# EAGLE schematic teensyShield4.1b (EAGLE 7.7.0)
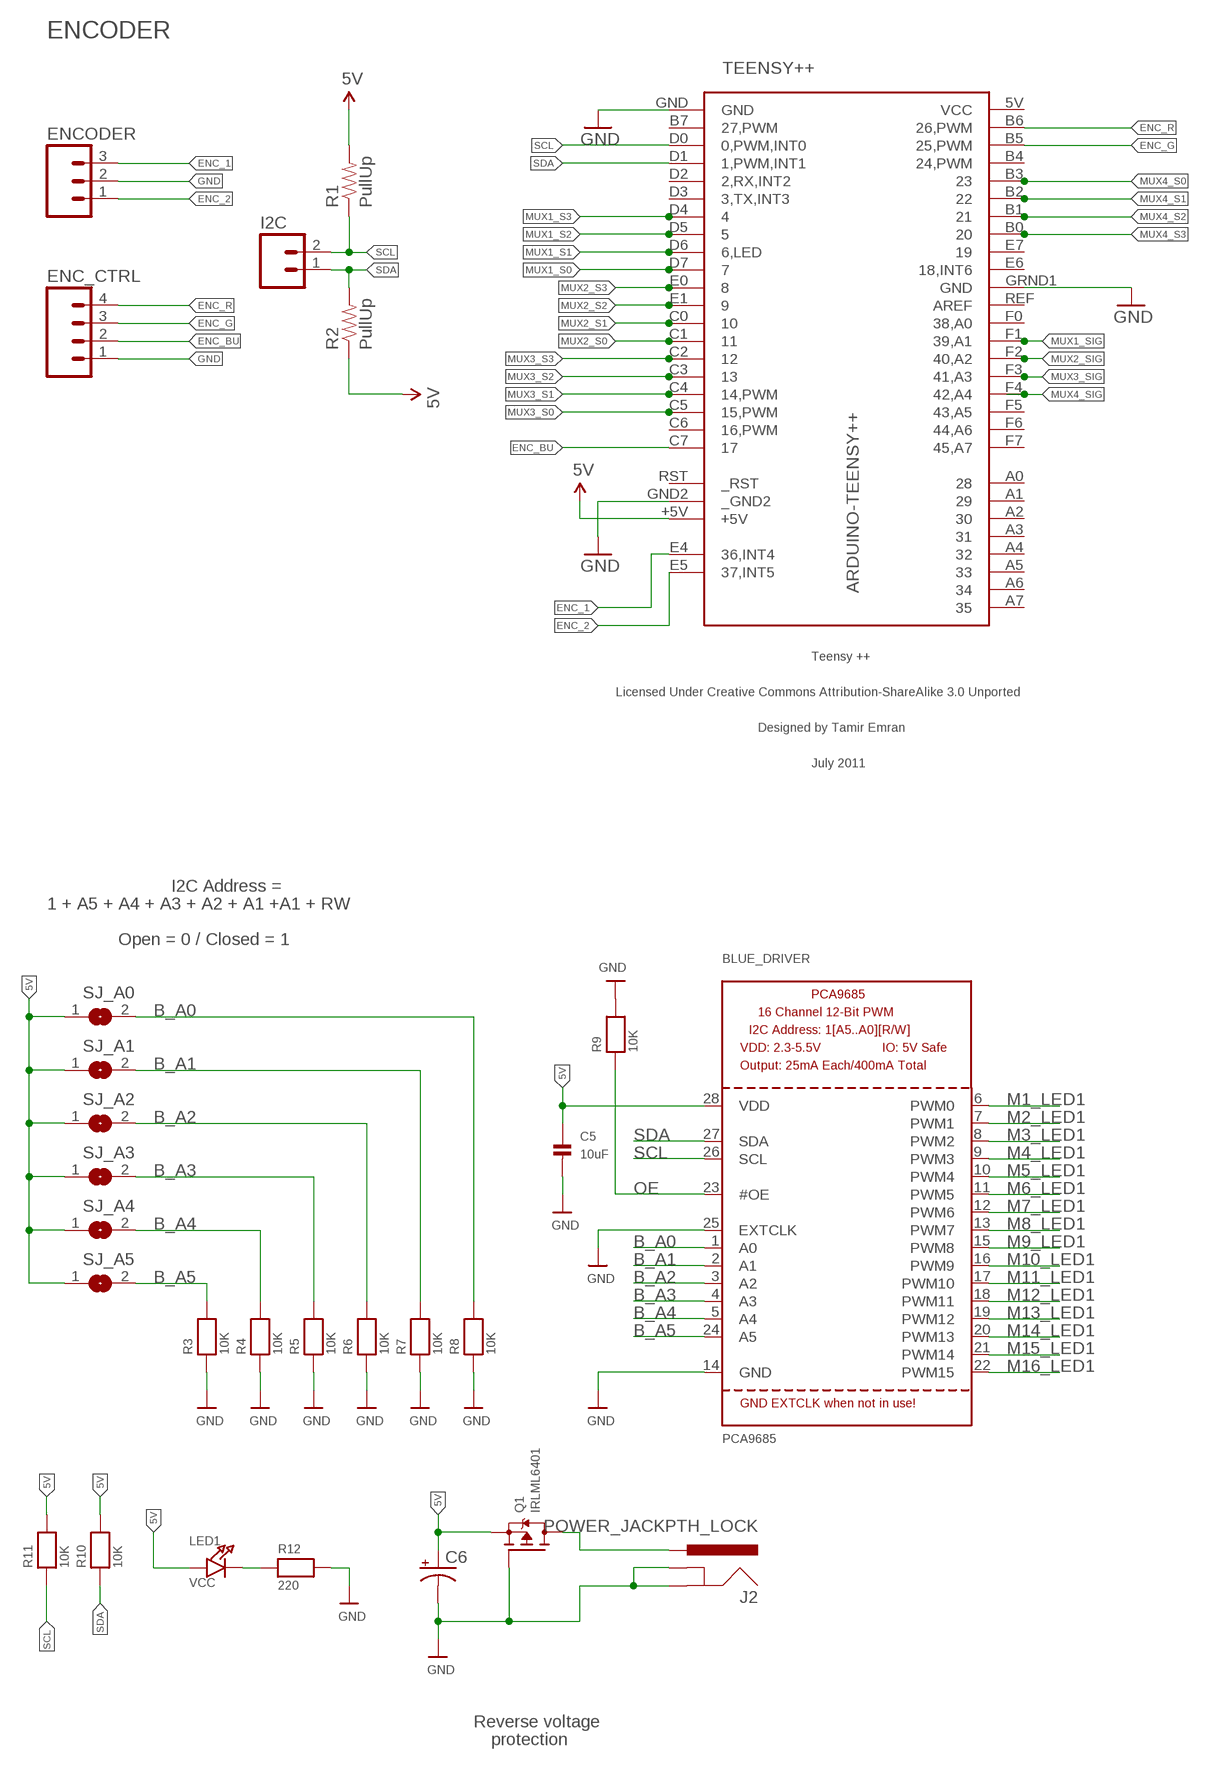
[diagram p0: schematic, sheet 1, part 1 of 2]
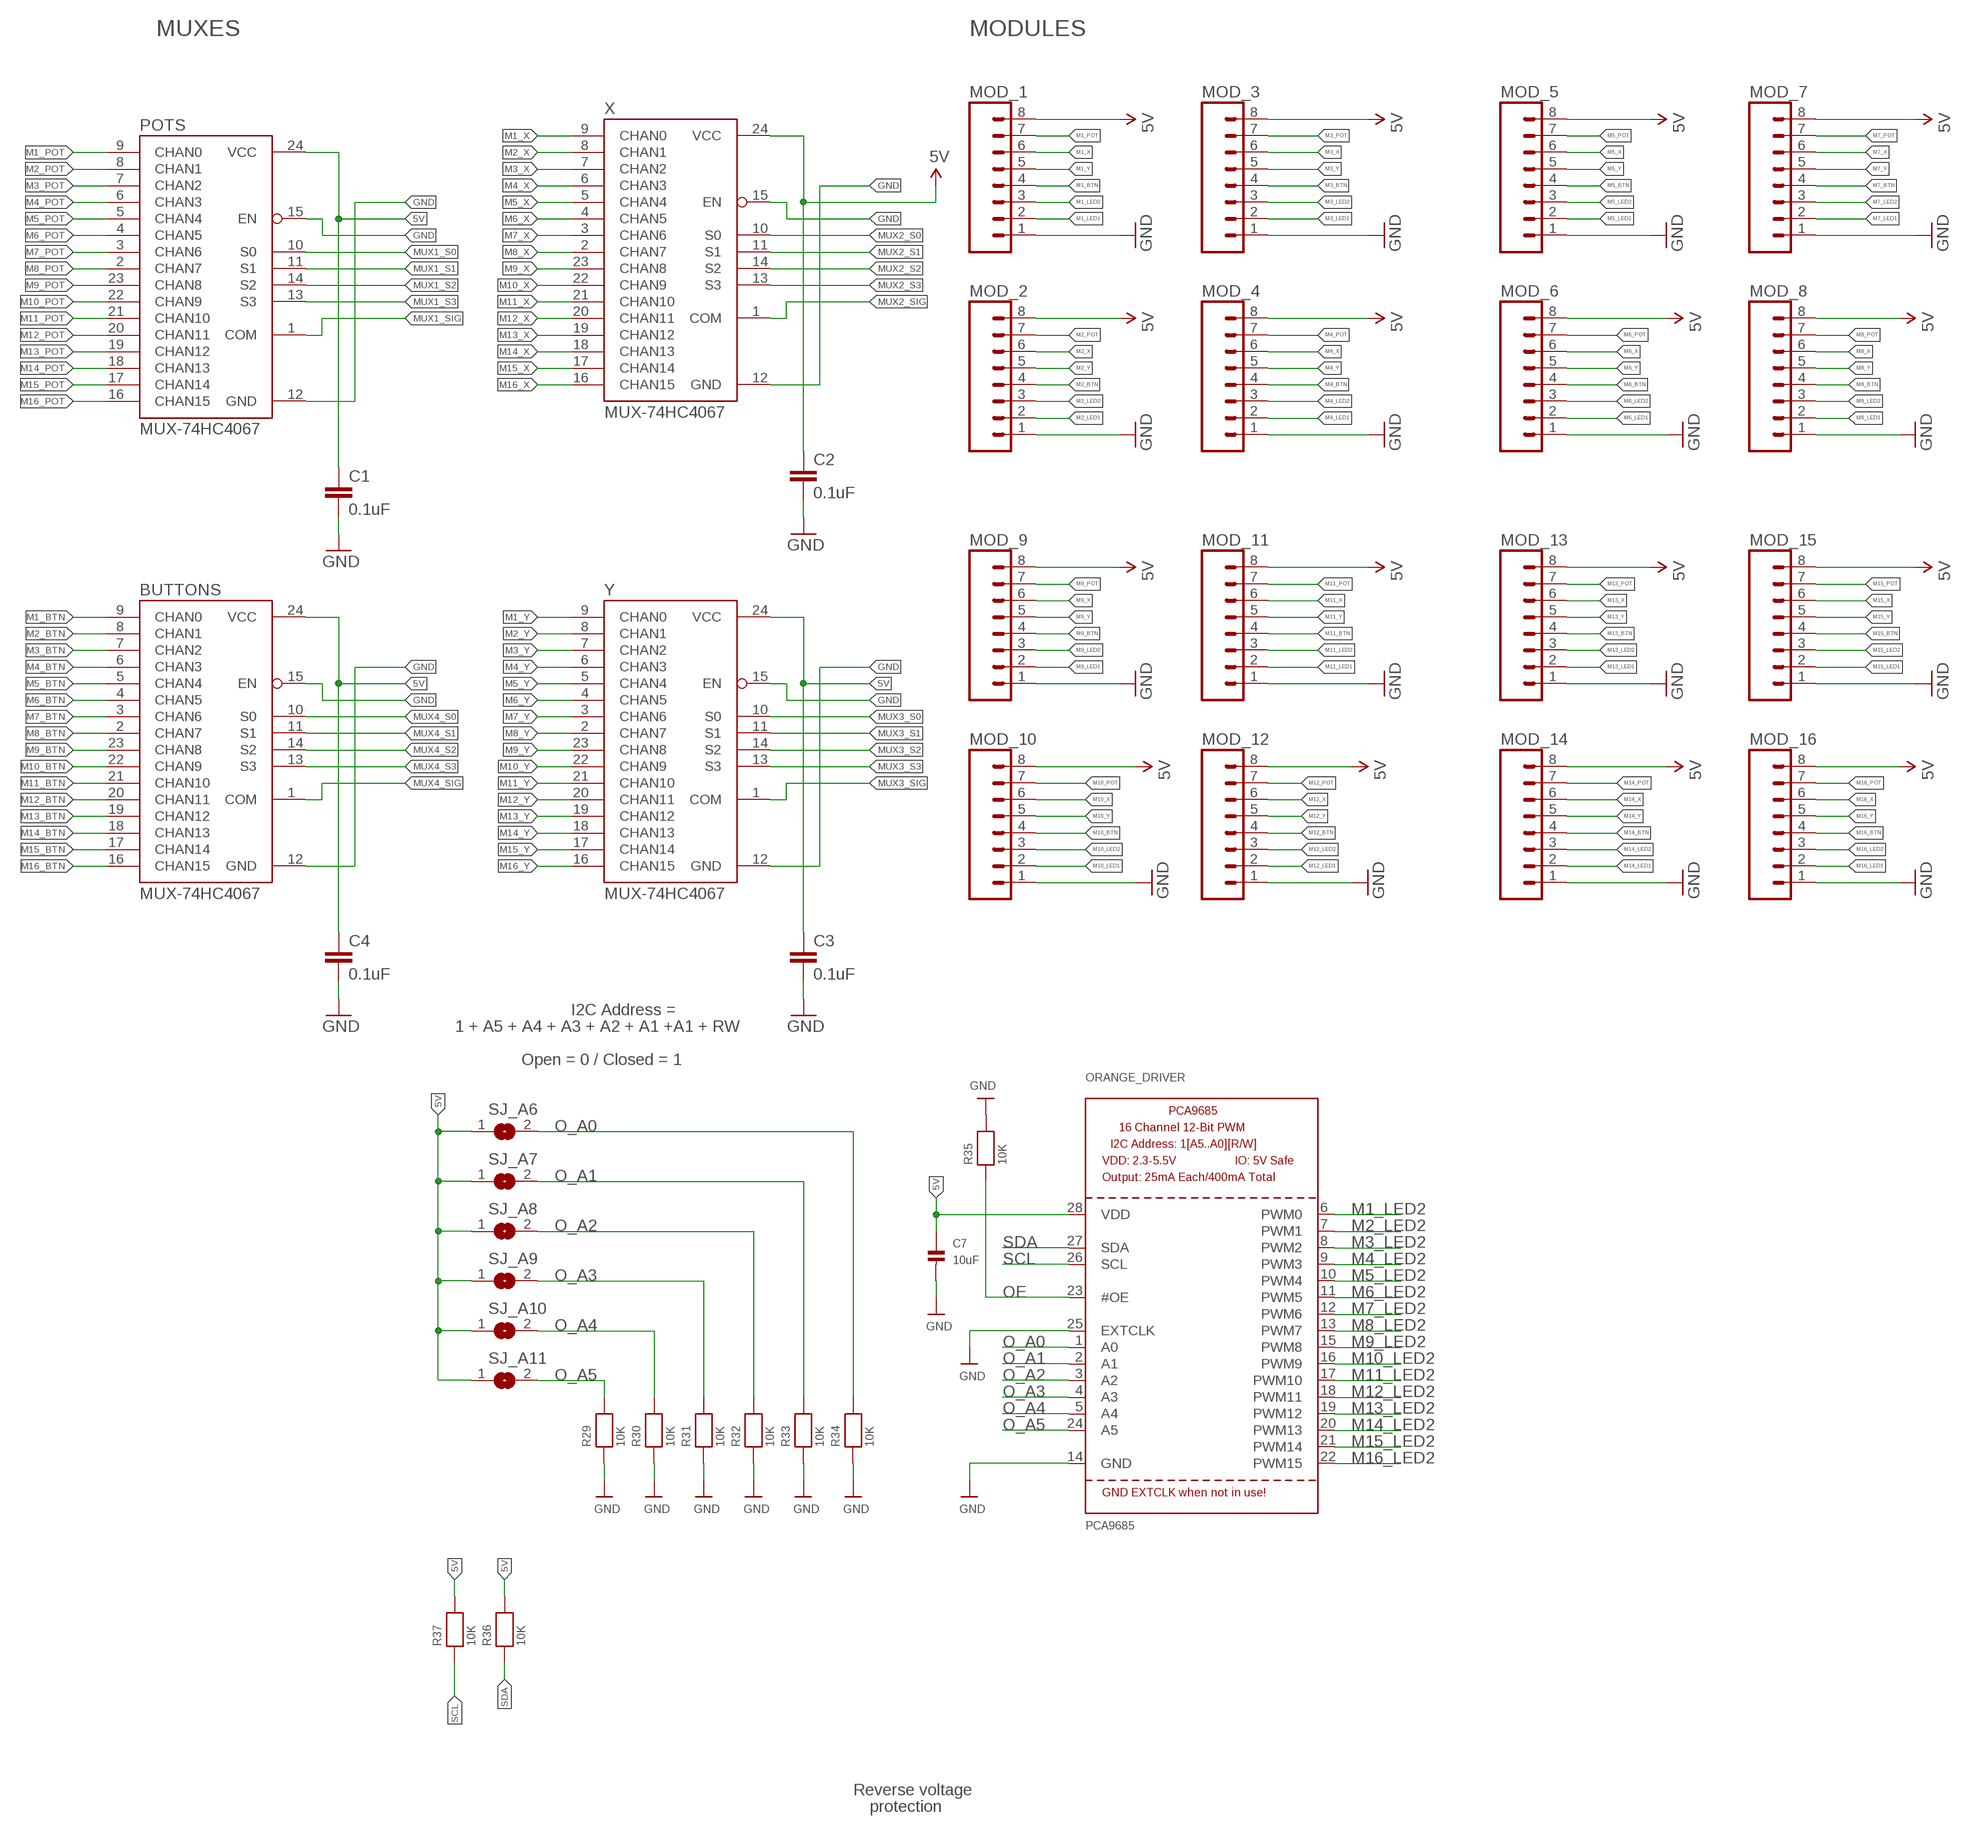
[diagram p1: schematic, sheet 1, part 2 of 2]

## Parts
BLUE_DRIVER  PCA9685  [TSSOP28]
BUTTONS  MUX-74HC4067  MUX-74HC4067SMD  [SSOP24]
C1  0.1uF  CAP0603  [0603]
C2  0.1uF  CAP0603  [0603]
C3  0.1uF  CAP0603  [0603]
C4  0.1uF  CAP0603  [0603]
C5  10uF  CAP_CERAMIC0805  [0805]
C6  CPOL-USE3.5-8  [E3,5-8]
C7  10uF  CAP_CERAMIC0805  [0805]
ENC_CTRL  M041X04_NO_SILK  [1X04_NO_SILK]
ENCODER  M031X03_NO_SILK  [1X03_NO_SILK]
I2C  M02LOCK  [1X02_LOCK]
J2  POWER_JACKPTH_LOCK  [POWER_JACK_PTH_LOCK]
LED1  VCC  LED0805  [CHIPLED_0805]
MOD_1  M08  [1X08_ROUND]
MOD_2  M08  [1X08_ROUND]
MOD_3  M08  [1X08_ROUND]
MOD_4  M08  [1X08_ROUND]
MOD_5  M08  [1X08_ROUND]
MOD_6  M08  [1X08_ROUND]
MOD_7  M08  [1X08_ROUND]
MOD_8  M08  [1X08_ROUND]
MOD_9  M08  [1X08_ROUND]
MOD_10  M08  [1X08_ROUND]
MOD_11  M08  [1X08_ROUND]
MOD_12  M08  [1X08_ROUND]
MOD_13  M08  [1X08_ROUND]
MOD_14  M08  [1X08_ROUND]
MOD_15  M08  [1X08_ROUND]
MOD_16  M08  [1X08_ROUND]
ORANGE_DRIVER  PCA9685  [TSSOP28]
POTS  MUX-74HC4067  MUX-74HC4067SMD  [SSOP24]
Q1  IRLML6401  MOSFET-PWIDE  [SOT23-WIDE]
R1  PullUp  10KOHM-1/4W5%(PTH)  [AXIAL-0.3]
R2  PullUp  10KOHM-1/4W5%(PTH)  [AXIAL-0.3]
R3  10K  RESISTOR0805  [0805]
R4  10K  RESISTOR0805  [0805]
R5  10K  RESISTOR0805  [0805]
R6  10K  RESISTOR0805  [0805]
R7  10K  RESISTOR0805  [0805]
R8  10K  RESISTOR0805  [0805]
R9  10K  RESISTOR0805  [0805]
R10  10K  RESISTOR0805  [0805]
R11  10K  RESISTOR0805  [0805]
R12  220  RESISTOR0805  [0805]
R29  10K  RESISTOR0805  [0805]
R30  10K  RESISTOR0805  [0805]
R31  10K  RESISTOR0805  [0805]
R32  10K  RESISTOR0805  [0805]
R33  10K  RESISTOR0805  [0805]
R34  10K  RESISTOR0805  [0805]
R35  10K  RESISTOR0805  [0805]
R36  10K  RESISTOR0805  [0805]
R37  10K  RESISTOR0805  [0805]
SJ_A0  SOLDERJUMPERREFLOW_NOPASTE  [SOLDERJUMPER_REFLOW_NOPASTE]
SJ_A1  SOLDERJUMPERREFLOW_NOPASTE  [SOLDERJUMPER_REFLOW_NOPASTE]
SJ_A2  SOLDERJUMPERREFLOW_NOPASTE  [SOLDERJUMPER_REFLOW_NOPASTE]
SJ_A3  SOLDERJUMPERREFLOW_NOPASTE  [SOLDERJUMPER_REFLOW_NOPASTE]
SJ_A4  SOLDERJUMPERREFLOW_NOPASTE  [SOLDERJUMPER_REFLOW_NOPASTE]
SJ_A5  SOLDERJUMPERREFLOW_NOPASTE  [SOLDERJUMPER_REFLOW_NOPASTE]
SJ_A6  SOLDERJUMPERREFLOW_NOPASTE  [SOLDERJUMPER_REFLOW_NOPASTE]
SJ_A7  SOLDERJUMPERREFLOW_NOPASTE  [SOLDERJUMPER_REFLOW_NOPASTE]
SJ_A8  SOLDERJUMPERREFLOW_NOPASTE  [SOLDERJUMPER_REFLOW_NOPASTE]
SJ_A9  SOLDERJUMPERREFLOW_NOPASTE  [SOLDERJUMPER_REFLOW_NOPASTE]
SJ_A10  SOLDERJUMPERREFLOW_NOPASTE  [SOLDERJUMPER_REFLOW_NOPASTE]
SJ_A11  SOLDERJUMPERREFLOW_NOPASTE  [SOLDERJUMPER_REFLOW_NOPASTE]
TEENSY++  ARDUINO-TEENSY++  [TEENSY++]
X  MUX-74HC4067  MUX-74HC4067SMD  [SSOP24]
Y  MUX-74HC4067  MUX-74HC4067SMD  [SSOP24]

## Nets
5V [5V]: BLUE_DRIVER.28(VDD) BUTTONS.24(VCC) C1.1 C2.1 C3.1 C4.1 C5.1 C6.+ C7.1 LED1.A MOD_1.8 MOD_2.8 MOD_3.8 MOD_4.8 MOD_5.8 MOD_6.8 MOD_7.8 MOD_8.8 MOD_9.8 MOD_10.8 MOD_11.8 MOD_12.8 MOD_13.8 MOD_14.8 MOD_15.8 MOD_16.8 ORANGE_DRIVER.28(VDD) POTS.24(VCC) Q1.2(S) R1.P$2 R2.P$1 R10.2 R11.2 R36.2 R37.2 SJ_A0.1 SJ_A1.1 SJ_A2.1 SJ_A3.1 SJ_A4.1 SJ_A5.1 SJ_A6.1 SJ_A7.1 SJ_A8.1 SJ_A9.1 SJ_A10.1 SJ_A11.1 TEENSY++.+5V X.24(VCC) Y.24(VCC)
B_A0: BLUE_DRIVER.1(A0) R8.2 SJ_A0.2
B_A1: BLUE_DRIVER.2(A1) R7.2 SJ_A1.2
B_A2: BLUE_DRIVER.3(A2) R6.2 SJ_A2.2
B_A3: BLUE_DRIVER.4(A3) R5.2 SJ_A3.2
B_A4: BLUE_DRIVER.5(A4) R4.2 SJ_A4.2
B_A5: BLUE_DRIVER.24(A5) R3.2 SJ_A5.2
ENC_1: ENCODER.3 TEENSY++.E4(36,INT4)
ENC_2: ENCODER.1 TEENSY++.E5(37,INT5)
ENC_BU: ENC_CTRL.2 TEENSY++.C7
ENC_G: ENC_CTRL.3 TEENSY++.B5(25,PWM)
ENC_R: ENC_CTRL.4 TEENSY++.B6(26,PWM)
GND [5V]: BLUE_DRIVER.14(GND) BLUE_DRIVER.25(EXTCLK) BUTTONS.12(GND) BUTTONS.15(EN) C1.2 C2.2 C3.2 C4.2 C5.2 C6.- C7.2 ENC_CTRL.1 ENCODER.2 J2.GND J2.GNDBREAK MOD_1.1 MOD_2.1 MOD_3.1 MOD_4.1 MOD_5.1 MOD_6.1 MOD_7.1 MOD_8.1 MOD_9.1 MOD_10.1 MOD_11.1 MOD_12.1 MOD_13.1 MOD_14.1 MOD_15.1 MOD_16.1 ORANGE_DRIVER.14(GND) ORANGE_DRIVER.25(EXTCLK) POTS.12(GND) POTS.15(EN) Q1.1(G) R3.1 R4.1 R5.1 R6.1 R7.1 R8.1 R9.2 R12.2 R29.1 R30.1 R31.1 R32.1 R33.1 R34.1 R35.2 TEENSY++.GND TEENSY++.GND2(_GND2) TEENSY++.GRND1(GND) X.12(GND) X.15(EN) Y.12(GND) Y.15(EN)
M1_BTN: BUTTONS.9(CHAN0) MOD_1.4
M1_LED1: BLUE_DRIVER.6(PWM0) MOD_1.2
M1_LED2: MOD_1.3 ORANGE_DRIVER.6(PWM0)
M1_POT: MOD_1.7 POTS.9(CHAN0)
M1_X: MOD_1.6 X.9(CHAN0)
M1_Y: MOD_1.5 Y.9(CHAN0)
M2_BTN: BUTTONS.8(CHAN1) MOD_2.4
M2_LED1: BLUE_DRIVER.7(PWM1) MOD_2.2
M2_LED2: MOD_2.3 ORANGE_DRIVER.7(PWM1)
M2_POT: MOD_2.7 POTS.8(CHAN1)
M2_X: MOD_2.6 X.8(CHAN1)
M2_Y: MOD_2.5 Y.8(CHAN1)
M3_BTN: BUTTONS.7(CHAN2) MOD_3.4
M3_LED1: BLUE_DRIVER.8(PWM2) MOD_3.2
M3_LED2: MOD_3.3 ORANGE_DRIVER.8(PWM2)
M3_POT: MOD_3.7 POTS.7(CHAN2)
M3_X: MOD_3.6 X.7(CHAN2)
M3_Y: MOD_3.5 Y.7(CHAN2)
M4_BTN: BUTTONS.6(CHAN3) MOD_4.4
M4_LED1: BLUE_DRIVER.9(PWM3) MOD_4.2
M4_LED2: MOD_4.3 ORANGE_DRIVER.9(PWM3)
M4_POT: MOD_4.7 POTS.6(CHAN3)
M4_X: MOD_4.6 X.6(CHAN3)
M4_Y: MOD_4.5 Y.6(CHAN3)
M5_BTN: BUTTONS.5(CHAN4) MOD_5.4
M5_LED1: BLUE_DRIVER.10(PWM4) MOD_5.2
M5_LED2: MOD_5.3 ORANGE_DRIVER.10(PWM4)
M5_POT: MOD_5.7 POTS.5(CHAN4)
M5_X: MOD_5.6 X.5(CHAN4)
M5_Y: MOD_5.5 Y.5(CHAN4)
M6_BTN: BUTTONS.4(CHAN5) MOD_6.4
M6_LED1: BLUE_DRIVER.11(PWM5) MOD_6.2
M6_LED2: MOD_6.3 ORANGE_DRIVER.11(PWM5)
M6_POT: MOD_6.7 POTS.4(CHAN5)
M6_X: MOD_6.6 X.4(CHAN5)
M6_Y: MOD_6.5 Y.4(CHAN5)
M7_BTN: BUTTONS.3(CHAN6) MOD_7.4
M7_LED1: BLUE_DRIVER.12(PWM6) MOD_7.2
M7_LED2: MOD_7.3 ORANGE_DRIVER.12(PWM6)
M7_POT: MOD_7.7 POTS.3(CHAN6)
M7_X: MOD_7.6 X.3(CHAN6)
M7_Y: MOD_7.5 Y.3(CHAN6)
M8_BTN: BUTTONS.2(CHAN7) MOD_8.4
M8_LED1: BLUE_DRIVER.13(PWM7) MOD_8.2
M8_LED2: MOD_8.3 ORANGE_DRIVER.13(PWM7)
M8_POT: MOD_8.7 POTS.2(CHAN7)
M8_X: MOD_8.6 X.2(CHAN7)
M8_Y: MOD_8.5 Y.2(CHAN7)
M9_BTN: BUTTONS.23(CHAN8) MOD_9.4
M9_LED1: BLUE_DRIVER.15(PWM8) MOD_9.2
M9_LED2: MOD_9.3 ORANGE_DRIVER.15(PWM8)
M9_POT: MOD_9.7 POTS.23(CHAN8)
M9_X: MOD_9.6 X.23(CHAN8)
M9_Y: MOD_9.5 Y.23(CHAN8)
M10_BTN: BUTTONS.22(CHAN9) MOD_10.4
M10_LED1: BLUE_DRIVER.16(PWM9) MOD_10.2
M10_LED2: MOD_10.3 ORANGE_DRIVER.16(PWM9)
M10_POT: MOD_10.7 POTS.22(CHAN9)
M10_X: MOD_10.6 X.22(CHAN9)
M10_Y: MOD_10.5 Y.22(CHAN9)
M11_BTN: BUTTONS.21(CHAN10) MOD_11.4
M11_LED1: BLUE_DRIVER.17(PWM10) MOD_11.2
M11_LED2: MOD_11.3 ORANGE_DRIVER.17(PWM10)
M11_POT: MOD_11.7 POTS.21(CHAN10)
M11_X: MOD_11.6 X.21(CHAN10)
M11_Y: MOD_11.5 Y.21(CHAN10)
M12_BTN: BUTTONS.20(CHAN11) MOD_12.4
M12_LED1: BLUE_DRIVER.18(PWM11) MOD_12.2
M12_LED2: MOD_12.3 ORANGE_DRIVER.18(PWM11)
M12_POT: MOD_12.7 POTS.20(CHAN11)
M12_X: MOD_12.6 X.20(CHAN11)
M12_Y: MOD_12.5 Y.20(CHAN11)
M13_BTN: BUTTONS.19(CHAN12) MOD_13.4
M13_LED1: BLUE_DRIVER.19(PWM12) MOD_13.2
M13_LED2: MOD_13.3 ORANGE_DRIVER.19(PWM12)
M13_POT: MOD_13.7 POTS.19(CHAN12)
M13_X: MOD_13.6 X.19(CHAN12)
M13_Y: MOD_13.5 Y.19(CHAN12)
M14_BTN: BUTTONS.18(CHAN13) MOD_14.4
M14_LED1: BLUE_DRIVER.20(PWM13) MOD_14.2
M14_LED2: MOD_14.3 ORANGE_DRIVER.20(PWM13)
M14_POT: MOD_14.7 POTS.18(CHAN13)
M14_X: MOD_14.6 X.18(CHAN13)
M14_Y: MOD_14.5 Y.18(CHAN13)
M15_BTN: BUTTONS.17(CHAN14) MOD_15.4
M15_LED1: BLUE_DRIVER.21(PWM14) MOD_15.2
M15_LED2: MOD_15.3 ORANGE_DRIVER.21(PWM14)
M15_POT: MOD_15.7 POTS.17(CHAN14)
M15_X: MOD_15.6 X.17(CHAN14)
M15_Y: MOD_15.5 Y.17(CHAN14)
M16_BTN: BUTTONS.16(CHAN15) MOD_16.4
M16_LED1: BLUE_DRIVER.22(PWM15) MOD_16.2
M16_LED2: MOD_16.3 ORANGE_DRIVER.22(PWM15)
M16_POT: MOD_16.7 POTS.16(CHAN15)
M16_X: MOD_16.6 X.16(CHAN15)
M16_Y: MOD_16.5 Y.16(CHAN15)
MUX1_S0: POTS.10(S0) TEENSY++.D7
MUX1_S1: POTS.11(S1) TEENSY++.D6(6,LED)
MUX1_S2: POTS.14(S2) TEENSY++.D5
MUX1_S3: POTS.13(S3) TEENSY++.D4
MUX1_SIG: POTS.1(COM) TEENSY++.F1(39,A1)
MUX2_S0: TEENSY++.C1 X.10(S0)
MUX2_S1: TEENSY++.C0 X.11(S1)
MUX2_S2: TEENSY++.E1 X.14(S2)
MUX2_S3: TEENSY++.E0 X.13(S3)
MUX2_SIG: TEENSY++.F2(40,A2) X.1(COM)
MUX3_S0: TEENSY++.C5(15,PWM) Y.10(S0)
MUX3_S1: TEENSY++.C4(14,PWM) Y.11(S1)
MUX3_S2: TEENSY++.C3 Y.14(S2)
MUX3_S3: TEENSY++.C2 Y.13(S3)
MUX3_SIG: TEENSY++.F3(41,A3) Y.1(COM)
MUX4_S0: BUTTONS.10(S0) TEENSY++.B3
MUX4_S1: BUTTONS.11(S1) TEENSY++.B2
MUX4_S2: BUTTONS.14(S2) TEENSY++.B1
MUX4_S3: BUTTONS.13(S3) TEENSY++.B0
MUX4_SIG: BUTTONS.1(COM) TEENSY++.F4(42,A4)
N$1: LED1.C R12.1
O_A0: ORANGE_DRIVER.1(A0) R34.2 SJ_A6.2
O_A1: ORANGE_DRIVER.2(A1) R33.2 SJ_A7.2
O_A2: ORANGE_DRIVER.3(A2) R32.2 SJ_A8.2
O_A3: ORANGE_DRIVER.4(A3) R31.2 SJ_A9.2
O_A4: ORANGE_DRIVER.5(A4) R30.2 SJ_A10.2
O_A5: ORANGE_DRIVER.24(A5) R29.2 SJ_A11.2
OE: BLUE_DRIVER.23(#OE) ORANGE_DRIVER.23(#OE) R9.1 R35.1
PWRIN [5V]: J2.PWR Q1.3(D)
SCL: BLUE_DRIVER.26(SCL) I2C.2 ORANGE_DRIVER.26(SCL) R1.P$1 R11.1 R37.1 TEENSY++.D0(0,PWM,INT0)
SDA: BLUE_DRIVER.27(SDA) I2C.1 ORANGE_DRIVER.27(SDA) R2.P$2 R10.1 R36.1 TEENSY++.D1(1,PWM,INT1)
Unconnected: TEENSY++.A0 TEENSY++.A1 TEENSY++.A2 TEENSY++.A3 TEENSY++.A4 TEENSY++.A5 TEENSY++.A6 TEENSY++.A7 TEENSY++.B4(24,PWM) TEENSY++.B7(27,PWM) TEENSY++.C6(16,PWM) TEENSY++.D2(2,RX,INT2) TEENSY++.D3(3,TX,INT3) TEENSY++.E6(18,INT6) TEENSY++.E7 TEENSY++.F0(38,A0) TEENSY++.F5(43,A5) TEENSY++.F6(44,A6) TEENSY++.F7(45,A7) TEENSY++.REF(AREF) TEENSY++.RST(_RST)

## Notes on the sheet
- MUXES | MODULES
- ENCODER
- I2C Address = | I2C Address =
- 1 + A5 + A4 + A3 + A2 + A1 +A1 + RW | 1 + A5 + A4 + A3 + A2 + A1 +A1 + RW
- Open = 0 / Closed = 1 | Open = 0 / Closed = 1
- Reverse voltage | Reverse voltage
- protection | protection

## Power pins joined to a net without a drawn wire
VCC: TEENSY++.5V(VCC)

## Library data of the parts
BLUE_DRIVER ORANGE_DRIVER = microbuilder:PCA9685: PCA9685 - 16 Channel 12-Bit I2C PWM Controller 5.0V tolerant 16 channel, 12-bit I2C PWM controller with 25mA per output (max. 400mA total) Digikey: 568-5931-1-ND
BUTTONS POTS X Y = SparkFun:MUX-74HC4067
C1-C4 = SparkFun:CAP: Capacitor Standard 0603 ceramic capacitor, and 0.1" leaded capacitor.
C5 C7 = microbuilder:CAP_CERAMIC: Ceramic Capacitors 0402 - 0402 Surface Mount Capacitors 16pF 50V 5% [Digikey: 445-4899-2-ND] 18pF 50V 5% [Digikey: 490-1281-2-ND] 22pF 50V 5% [Digikey: 490-1283-2-ND] 68pF 50V 5% [Digikey: 490-1289-2-ND] 0.1uF 10V 10% [Digikey: 490-1318-2-ND] 1.0uF 6.3V 10% [Digikey: 490-1320-2-ND] 0603 - 0603 Surface Mount Capacitors 16 pF 50V 5% [Digikey: 445-5051-2-ND] 22 pF 50V [Digikey: PCC220ACVTR-ND] 33 pF 50V 5% [Digikey: 490-1415-1-ND] 56pF 50V 5% [Digikey: 490-1421-1-ND] 220pF 50V 5% [Digikey: 445-1285-1-ND] 680 pF 50V 2200 pF 50V 5% C0G [Digikey: 445-1297-1-ND] 5600 pF 100V 5% X7R [Digikey: 478-3711-1-ND] 0.1 µF 25V 10% [Digikey: PCC2277TR-ND] 0.22 µF 16V 10% X7R [Digikey: 445-1318-1-ND] 1.0 µF 25V 10% [Digikey: 445-5146-2-ND] 0603 - RF Specific 3pF 250V +/-0.1pF RF [Digikey: 712-1347-1-ND] 18 pF 250V 5% [Digikey: 478-3505-1-ND or 712-1322-1-ND] 56 pF 250V 5% C0G RF [Digikey: 490-4867-1-ND] 68 pF 250V RF [Digikey: 490-4868-1-ND] 0805 - 0805 Surface Mount Capacitors 220 pF 250V 2% RF Ceramic Capacitor [Digikey: 712-1398-1-ND] 1000 pF 50V 2% NP0 Ceramic Capacitor [Digikey: 478-3760-1-ND] 0.1 µF 25V 10% Ceramic Capacitor [Digikey: PCC1828TR-ND] 1.0 µF 16V 10% Ceramic Capacitor[Digikey: 490-1691-2-ND] 10.0 µF 10V 10% Ceramic Capacitor[Digikey: 709-1228-1-ND] 10.0 uF 16V 10% Ceramic Capacitor [Digikey: 478-5165-2-ND] 47 uF 6.3V 20% Ceramic Capacitor [Digikey: 587-1779-1-ND or 399-5506-1-ND] 1206 - 1206 Surface Mount Capacitors 47uF 10V 20% Ceramic Capacitor [Digikey: 490-5528-1-ND or 399-5508-1-ND or 445-6010-1-ND] 100uF 6.3V -20%, +80% Y5V Ceramic Capacitor (Digikey: 490-4512-1-ND, Mouser: 81-GRM31CF50J107ZE1L)
C6 = adafruit:CPOL-US: POLARIZED CAPACITOR, American symbol
ENC_CTRL = SparkFun-Connectors:M04: Header 4 Standard 4-pin 0.1" header. Use with straight break away headers (SKU : PRT-00116), right angle break away headers (PRT-00553), swiss pins (PRT-00743), machine pins (PRT-00117), and female headers (PRT-00115). Molex polarized connector foot print use with SKU : PRT-08231 with associated crimp pins and housings. 1MM SMD Version SKU: PRT-10208; PROD_ID: CONN-09696
ENCODER = SparkFun-Connectors:M03: Header 3 Standard 3-pin 0.1" header. Use with straight break away headers (SKU : PRT-00116), right angle break away headers (PRT-00553), swiss pins (PRT-00743), machine pins (PRT-00117), and female headers (PRT-00115). Molex polarized connector foot print use with SKU : PRT-08232 with associated crimp pins and housings.
I2C = SparkFun-Connectors:M02: Standard 2-pin 0.1" header. Use with - straight break away headers ( PRT-00116) - right angle break away headers (PRT-00553) - swiss pins (PRT-00743) - machine pins (PRT-00117) - female headers (PRT-00115) Molex polarized connector foot print use with: PRT-08233 with associated crimp pins and housings. 2.54_SCREWTERM for use with PRT-10571. 3.5mm Screw Terminal footprints for PRT-08084 5mm Screw Terminal footprints for use with PRT-08432
J2 = SparkFun-Connectors:POWER_JACK: Power Jack This is the standard 5.5mm barrel jack for power. The PTH is the most common, proven, reliable, footprint. The Slot footprint only works if the mill layer is transmitted to the PCB fab house so be warned. Mating wall wart : TOL-00298 (and others); PROD_ID: CONN-08197; SF_ID: PRT-00119
LED1 = microbuilder:LED: LED 0603 - 0603 Surface Mount Package 2mA: Green LED - Low Power (3.9mcd, 2ma, 1.7Vf) - Digikey: 475-2709-2-ND Orange LED - Low Power (9.8mcd, 2ma, 1.8Vf) - Digikey: 475-1194-2-ND Red LED - Low Power (5mcd, 2ma, 1.8Vf) - Digikey: 475-1195-2-ND Yellow LED - Low Power (7mcd, 2ma, 1.8Vf) - Digikey: 475-1196-2-ND 5mA: Blue LED - Low Power (17mcd, 5ma, 2.9Vf) - Digikey: LNJ937W8CRACT-ND 0805 - 0805 Surface Mount Package 2mA: Red LED (8.8mcd, 2mA, 1.8Vf, Clear) - Low Power [Digikey: 475-2510-1-ND] Green LED (5mcd, 2mA, 1.8Vf, Clear) - Low Power [Digikey: 475-2730-1-ND] Yellow LED (11.3mcd, 2mA, 1.8Vf, Clear) - Low Power [Digikey: 475-2555-1-ND] 20mA: Red LED (104mcd, 20mA, Diffused) - LS R976 [Digikey: 475-1278-6-ND] Red LED (12mcd, 20mA, 2.0Vf, Clear) - APT2012EC [Digikey: 754-1128-1-ND] Green LED (15mcd, 20mA, 2.2Vf, Clear) - APT2012GC [Digikey: 754-1131-1-ND] Orange LED (160mcd, 20mA, 2.1Vf, Clear) - APT2012SECK [Digikey: 754-1130-1-ND] 1206 - 1206 Surface Mount Package Green LED (26mcd, 20mA, Diffused) - LG N971 [Digikey: 475-1407-6-ND] Red LED (15mcd, 20mA, Diffused) - LH N974 [Digikey: 475-1416-6-ND]
MOD_1-MOD_16 = SparkFun-Connectors:M08: Header 8 Standard 8-pin 0.1" header. Use with straight break away headers (SKU : PRT-00116), right angle break away headers (PRT-00553), swiss pins (PRT-00743), machine pins (PRT-00117), and female headers (PRT-00115).; PROD_ID: CONN-08437
Q1 = microbuilder:MOSFET-P: P-Channel Mosfet LEGEND VDS: Voltage Drain-Source ID: Drain Current RDS(ON): Drain-Source On-State Resistance VGS(TH): Gate-Source Threshold Voltage CISS: Drain-Source Input Capacitance SOT-23 Name VDS ID RDS(ON) VGS(TH) CISS Order Number IRLML5103 30V 760mA 600 mOhm -- 75pF @ 25V Digikey: IRLML5103PBFCT-ND NTR0202PL 20V 400mA 800 mOhm 2.3V @ 250uA 70pF @ 5V Digikey: NTR0202PLT1GOSTR-ND NTR4101PT1G 20V 1.8A 85 mOhm 1.2V @ 250uA 675pF @ 10V Digikey: NTR4101PT1GOSCT-ND DMP2004K 20V 600mA 900 mOhm 1V @ 250uA 175pF @ 16V Digikey: DMP2004KDICT-ND PMV65XP 20V 3.9A 76 mOhm 950mV @ 1mA 725pF @ 20V Digikey: 568-2358-2-ND TO-252 Name VDS ID RDS(ON) VGS(TH) CISS Order Number AOD417 30V 25A 34 mOhm 3V @ 250µA 920pF @ 15V Digikey: 785-1106-2-ND
R1 R2 = SparkFun-Resistors:10KOHM-1/4W5%(PTH): RES-09435; PROD_ID: RES-9435; VALUE: 10k
R3-R12 R29-R37 = microbuilder:RESISTOR: Resistors 0402 - 0402 Surface Mount Package 22 Ohm 1% 1/16W [Digikey: 311-22.0LRTR-ND] 33 Ohm 5% 1/16W 1.0K 5% 1/16W 1.5K 5% 1/16W 2.0K 1% 1/16W 10.0K 1% 1/16W [Digikey: 311-10.0KLRTR-ND] 10.0K 5% 1/16W [Digikey: RMCF0402JT10K0TR-ND] 12.1K 1% 1/16W [Digikey: 311-22.0LRTR-ND] 100.0K 5% 1/16W 0603 - 0603 Surface Mount Package 0 Ohm 1/10 Watt 1% Resistor 15 Ohm 1/10 Watt 1% Resistor 33 Ohm 1/10 Watt 1% Resistor 49.9 Ohm 1/10 Watt 1% Resistor 100 Ohm 1/10 Watt 1% Resistor 150 Ohm 1/10 Watt 1% Resistor 240 Ohm 1/10 Watt 1% Resistor 390 Ohm 1/10 Watt 1% Resistor 560 Ohm 1/10 Watt 1% Resistor 680 Ohm 1/10 Watt 1% Resistor 750 Ohm 1/10 Watt 1% Resistor 1.0K Ohm 1/10 Watt 1% Resistor 1.5K Ohm 1/10 Watt 1% Resistor 2.0K Ohm 1/10 Watt 1% Resistor 2.2K Ohm 1/10 Watt 1% Resistor 3.3K Ohm 1/10 Watt 1% Resistor 4.7K Ohm 1/10 Watt 1% Resistor 10.0K Ohm 1/10 Watt 1% Resistor 12.0K Ohm 1/10 Watt 1% Resistor 12.1K Ohm 1/10 Watt 1% Resistor 20.0K Ohm 1/10 Watt 1% Resistor 33.0K Ohm 1/10 Watt 1% Resistor 100.0K Ohm 1/10 Watt 1% Resistor 0805 - 0805 Surface Mount Package 0 Ohm 1/8 Watt 1% Resistor 33 Ohm 1/8 Watt 1% Resistor 100 Ohm 1/8 Watt 1% Resistor 150 Ohm 1/8 Watt 1% Resistor 200 Ohm 1/8 Watt 1% Resistor 240 Ohm 1/8 Watt 1% Resistor 330 Ohm 1/8 Watt 1% Resistor 390 Ohm 1/8 Watt 1% Resistor 470 Ohm 1/8 Watt 1% Resistor 1.0K Ohm 1/8 Watt 1% Resistor 1.5K Ohm 1/8 Watt 1% Resistor 2.0K Ohm 1/8 Watt 1% Resistor 4.7K Ohm 1/8 Watt 1% Resistor 5.1K Ohm 1/8 Watt 1% Resistor 5.6K Ohm 1/8 Watt 1% Resistor 10.0K Ohm 1/8 Watt 1% Resistor 22.0K Ohm 1/8 Watt 1% Resistor 33.0K Ohm 1/8 Watt 1% Resistor 100K Ohm 1/8 Watt 1% Resistor 1206 - 1206 Surface Mount Package 2012 - 2010 Surface Mount Package 0.11 Ohm 1/2 Watt 1% Resistor - Digikey: RHM.11UCT-ND
SJ_A0 SJ_A1-SJ_A11 = microbuilder:SOLDERJUMPER: SMD Solder JUMPER Solder the two pads together to create a connection, or remove the solder to break it. REFLOW - Use this footprint for solder paste and reflow ovens. WAVE - Use this footprint for hand-soldering (larger pads). CLOSED - Has a trace between the two pads to ensure it is closed by default. The trace needs to be cut to disable the jumper, and can be closed again by creating a solder bridge between the two pads.
TEENSY++ = teensypp:ARDUINO-TEENSY++: Teensy ++ Original Design by Mark Gross Modified Design by Tamir Emran Licensed Under Creative Commons Attribution-ShareAlike 3.0 Unported (CC BY-SA 3.0)

## Net classes
1 GND: width 0.508 mm
2 5V: width 0.508 mm